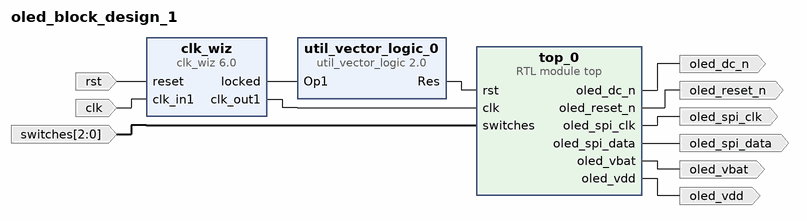
[diagram p0: block diagram of the top level]
# Vivado block design oled_block_design_1, xc7z020clg484-1, Vivado 2020.2
create_bd_design oled_block_design_1

create_bd_port -dir I rst
create_bd_port -dir O oled_spi_clk
create_bd_port -dir O oled_spi_data
create_bd_port -dir O oled_vdd
create_bd_port -dir O oled_vbat
create_bd_port -dir O oled_reset_n
create_bd_port -dir O oled_dc_n
create_bd_port -dir I -from 2 -to 0 switches
create_bd_port -dir I clk

create_bd_cell -type ip -vlnv xilinx.com:ip:clk_wiz:6.0 clk_wiz
create_bd_cell -type ip -vlnv xilinx.com:ip:util_vector_logic:2.0 util_vector_logic_0
set_property -dict {CONFIG.C_OPERATION not CONFIG.C_SIZE 1} [get_bd_cells util_vector_logic_0]
create_bd_cell -type module -reference top top_0

# ---- connections ----

connect_bd_net [get_bd_ports rst] [get_bd_pins clk_wiz/reset]
connect_bd_net [get_bd_pins util_vector_logic_0/Res] [get_bd_pins top_0/rst]
connect_bd_net [get_bd_pins clk_wiz/locked] [get_bd_pins util_vector_logic_0/Op1]
connect_bd_net [get_bd_ports clk] [get_bd_pins clk_wiz/clk_in1]
connect_bd_net [get_bd_pins clk_wiz/clk_out1] [get_bd_pins top_0/clk]
connect_bd_net [get_bd_ports switches] [get_bd_pins top_0/switches]
connect_bd_net [get_bd_pins top_0/oled_spi_clk] [get_bd_ports oled_spi_clk]
connect_bd_net [get_bd_pins top_0/oled_spi_data] [get_bd_ports oled_spi_data]
connect_bd_net [get_bd_pins top_0/oled_vdd] [get_bd_ports oled_vdd]
connect_bd_net [get_bd_pins top_0/oled_vbat] [get_bd_ports oled_vbat]
connect_bd_net [get_bd_pins top_0/oled_reset_n] [get_bd_ports oled_reset_n]
connect_bd_net [get_bd_pins top_0/oled_dc_n] [get_bd_ports oled_dc_n]

validate_bd_design
save_bd_design
